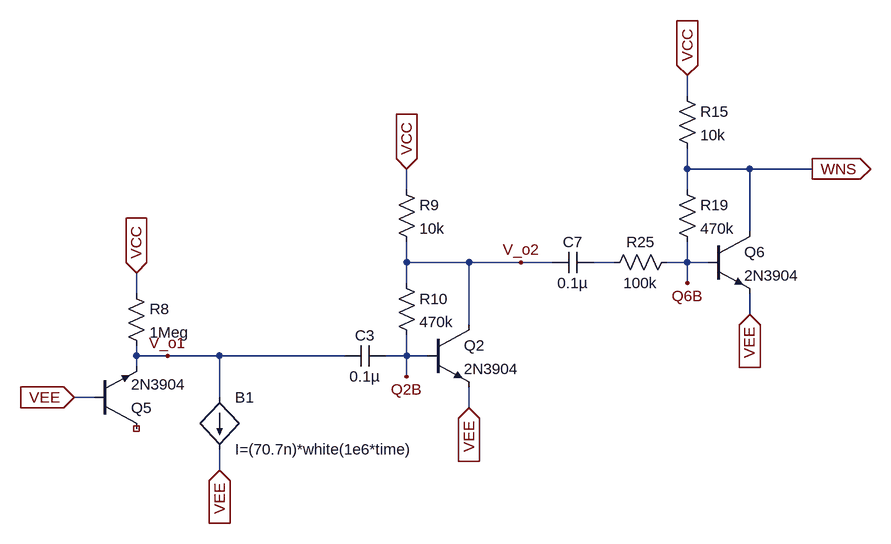
[diagram p0: schematic WhiteNoise.asc]
WhiteNoise.asc, the LTspice schematic file:
Version 4.1
SHEET 1 1048 680
WIRE 656 -256 656 -288
WIRE 656 -144 656 -176
WIRE 752 -144 656 -144
WIRE 848 -144 752 -144
WIRE 224 -112 224 -144
WIRE 656 -112 656 -144
WIRE 752 -48 752 -144
WIRE 224 0 224 -32
WIRE 320 0 224 0
WIRE 400 0 320 0
WIRE 448 0 400 0
WIRE 544 0 512 0
WIRE 656 0 656 -32
WIRE 656 0 624 0
WIRE 688 0 656 0
WIRE 224 32 224 0
WIRE 656 32 656 0
WIRE -192 48 -192 16
WIRE 752 80 752 48
WIRE 320 96 320 0
WIRE -192 144 -192 128
WIRE -144 144 -192 144
WIRE -64 144 -144 144
WIRE 128 144 -64 144
WIRE 224 144 224 112
WIRE 224 144 192 144
WIRE 256 144 224 144
WIRE -192 160 -192 144
WIRE 224 176 224 144
WIRE -256 208 -288 208
WIRE -64 208 -64 144
WIRE 320 224 320 192
WIRE -64 320 -64 288
FLAG -288 208 VEE
IOPIN -288 208 In
FLAG -192 16 VCC
IOPIN -192 16 In
FLAG -144 144 V_o1
FLAG 224 -144 VCC
IOPIN 224 -144 In
FLAG 320 224 VEE
IOPIN 320 224 In
FLAG 400 0 V_o2
FLAG 656 -288 VCC
IOPIN 656 -288 In
FLAG 752 80 VEE
IOPIN 752 80 In
FLAG 848 -144 WNS
IOPIN 848 -144 Out
FLAG -64 320 VEE
IOPIN -64 320 In
FLAG 224 176 Q2B
FLAG 656 32 Q6B
SYMBOL res -208 32 R0
SYMATTR InstName R8
SYMATTR Value 1Meg
SYMBOL npn -256 256 M180
SYMATTR InstName Q5
SYMATTR Value 2N3904
SYMBOL cap 192 128 R90
WINDOW 0 0 32 VBottom 2
WINDOW 3 32 32 VTop 2
SYMATTR InstName C3
SYMATTR Value 0.1µ
SYMBOL res 208 -128 R0
SYMATTR InstName R9
SYMATTR Value 10k
SYMBOL npn 256 96 R0
SYMATTR InstName Q2
SYMATTR Value 2N3904
SYMBOL res 208 16 R0
SYMATTR InstName R10
SYMATTR Value 470k
SYMBOL cap 512 -16 R90
WINDOW 0 0 32 VBottom 2
WINDOW 3 32 32 VTop 2
SYMATTR InstName C7
SYMATTR Value 0.1µ
SYMBOL res 640 -16 R90
WINDOW 0 0 56 VBottom 2
WINDOW 3 32 56 VTop 2
SYMATTR InstName R25
SYMATTR Value 100k
SYMBOL res 640 -272 R0
SYMATTR InstName R15
SYMATTR Value 10k
SYMBOL npn 688 -48 R0
SYMATTR InstName Q6
SYMATTR Value 2N3904
SYMBOL res 640 -128 R0
SYMATTR InstName R19
SYMATTR Value 470k
SYMBOL bi -64 208 R0
SYMATTR InstName B1
SYMATTR Value I=(70.7n)*white(1e6*time)

The netlist it stands for:
* WhiteNoise.asc
R8 VCC V_o1 1Meg
Q5 NC_01 VEE V_o1 0 2N3904
C3 Q2B V_o1 0.1µ
R9 VCC V_o2 10k
Q2 V_o2 Q2B VEE 0 2N3904
R10 V_o2 Q2B 470k
C7 N001 V_o2 0.1µ
R25 Q6B N001 100k
R15 VCC WNS 10k
Q6 WNS Q6B VEE 0 2N3904
R19 WNS Q6B 470k
B1 V_o1 VEE I=(70.7n)*white(1e6*time)
.model NPN NPN
.model PNP PNP
.lib standard.bjt
.backanno
.end